# Altium schematic sheet Thermal_Sens.SchDoc
size 259 x 167 mm; SheetNumber: 13; SheetTotal: 15
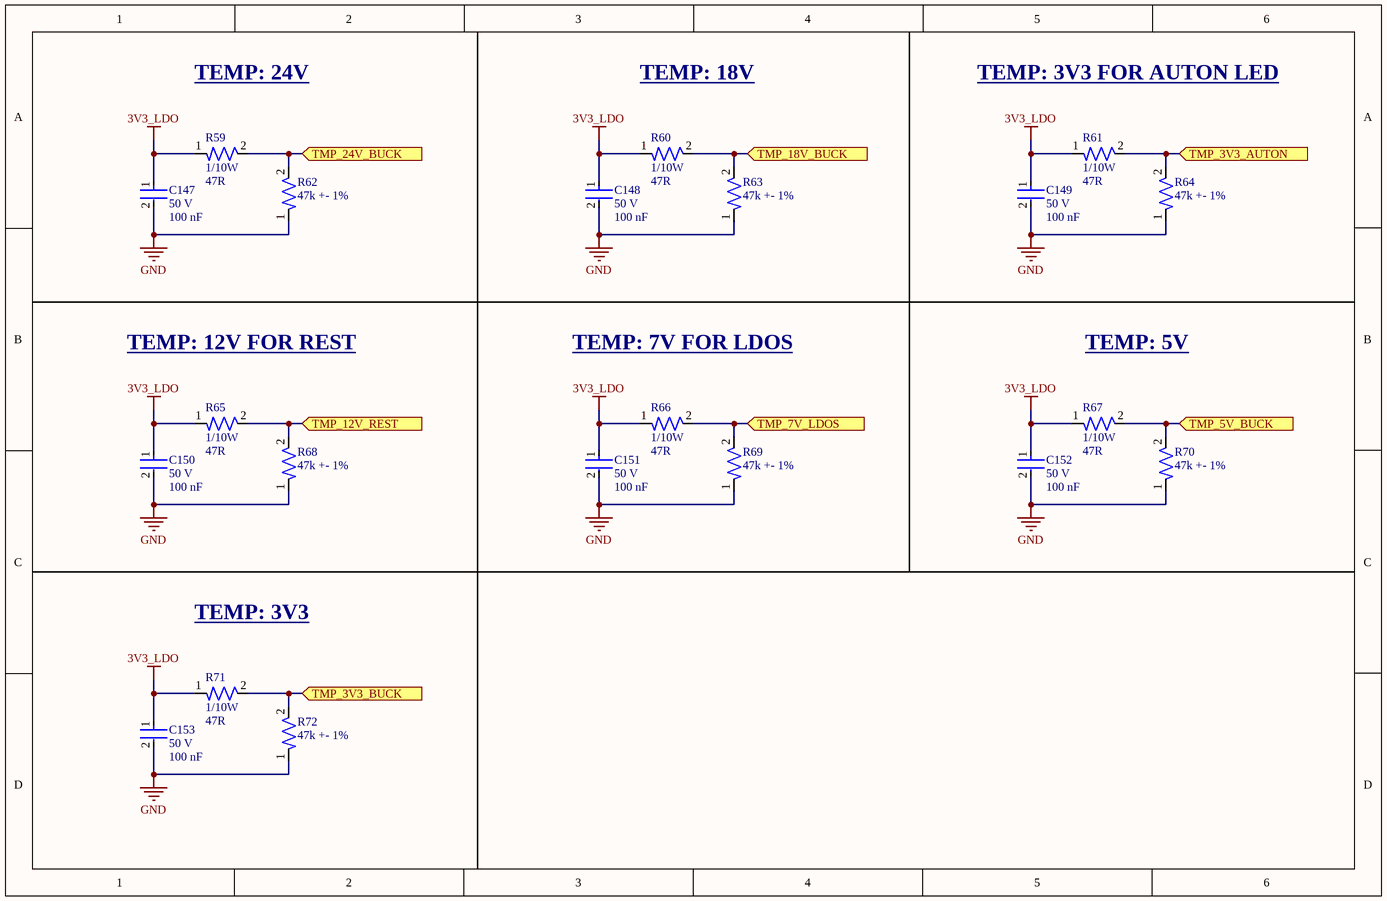
[diagram p0: Thermal_Sens.SchDoc]

## Parts
C147  Voltage Rating: 50 V  Capacitance: 100 nF  [CAP-0805]  (hidden comment: CC0805KRX7R9BB104)
C148  Voltage Rating: 50 V  Capacitance: 100 nF  [CAP-0805]  (hidden comment: CC0805KRX7R9BB104)
C149  Voltage Rating: 50 V  Capacitance: 100 nF  [CAP-0805]  (hidden comment: CC0805KRX7R9BB104)
C150  Voltage Rating: 50 V  Capacitance: 100 nF  [CAP-0805]  (hidden comment: CC0805KRX7R9BB104)
C151  Voltage Rating: 50 V  Capacitance: 100 nF  [CAP-0805]  (hidden comment: CC0805KRX7R9BB104)
C152  Voltage Rating: 50 V  Capacitance: 100 nF  [CAP-0805]  (hidden comment: CC0805KRX7R9BB104)
C153  Voltage Rating: 50 V  Capacitance: 100 nF  [CAP-0805]  (hidden comment: CC0805KRX7R9BB104)
R59  Power: 1/10W  Resistance: 47R  [RES-0603]  (hidden comment: RC0603FR-0747RL)
R60  Power: 1/10W  Resistance: 47R  [RES-0603]  (hidden comment: RC0603FR-0747RL)
R61  Power: 1/10W  Resistance: 47R  [RES-0603]  (hidden comment: RC0603FR-0747RL)
R62  Resistance: 47k +- 1%  [RES-0402]  (hidden comment: TMP6431DECR)
R63  Resistance: 47k +- 1%  [RES-0402]  (hidden comment: TMP6431DECR)
R64  Resistance: 47k +- 1%  [RES-0402]  (hidden comment: TMP6431DECR)
R65  Power: 1/10W  Resistance: 47R  [RES-0603]  (hidden comment: RC0603FR-0747RL)
R66  Power: 1/10W  Resistance: 47R  [RES-0603]  (hidden comment: RC0603FR-0747RL)
R67  Power: 1/10W  Resistance: 47R  [RES-0603]  (hidden comment: RC0603FR-0747RL)
R68  Resistance: 47k +- 1%  [RES-0402]  (hidden comment: TMP6431DECR)
R69  Resistance: 47k +- 1%  [RES-0402]  (hidden comment: TMP6431DECR)
R70  Resistance: 47k +- 1%  [RES-0402]  (hidden comment: TMP6431DECR)
R71  Power: 1/10W  Resistance: 47R  [RES-0603]  (hidden comment: RC0603FR-0747RL)
R72  Resistance: 47k +- 1%  [RES-0402]  (hidden comment: TMP6431DECR)

## Ports
TMP_3V3_AUTON (in), TMP_3V3_BUCK (in), TMP_5V_BUCK (in), TMP_7V_LDOS (in), TMP_12V_REST (in), TMP_18V_BUCK (in), TMP_24V_BUCK (in)

## Nets
3V3_LDO: C147.1 C148.1 C149.1 C150.1 C151.1 C152.1 C153.1 R59.1 R60.1 R61.1 R65.1 R66.1 R67.1 R71.1
GND: C147.2 C148.2 C149.2 C150.2 C151.2 C152.2 C153.2 R62.1 R63.1 R64.1 R68.1 R69.1 R70.1 R72.1
TMP_3V3_AUTON: R61.2 R64.2 ; port TMP_3V3_AUTON
TMP_3V3_BUCK: R71.2 R72.2 ; port TMP_3V3_BUCK
TMP_5V_BUCK: R67.2 R70.2 ; port TMP_5V_BUCK
TMP_7V_LDOS: R66.2 R69.2 ; port TMP_7V_LDOS
TMP_12V_REST: R65.2 R68.2 ; port TMP_12V_REST
TMP_18V_BUCK: R60.2 R63.2 ; port TMP_18V_BUCK
TMP_24V_BUCK: R59.2 R62.2 ; port TMP_24V_BUCK

## Notes on the sheet
- TEMP: 24V
- TEMP: 18V
- TEMP: 3V3 FOR AUTON LED
- TEMP: 12V FOR REST
- TEMP: 7V FOR LDOS
- TEMP: 5V
- TEMP: 3V3

## Library data of the parts
C147-C153 = CAP-0.1U-0002: CAP CER 0.1UF 50V X7R 0805; ComponentLink2Description: Datasheet; ComponentLink2URL: https://www.yageo.com/upload/media/product/productsearch/datasheet/mlcc/UPY-GPHC_X7R_6.3V-to-250V_24.pdf; Device Class: Ceramic; Size: 0805
R59-R61 R65-R67 R71 = RES-47-0001: RES 47 OHM 1% 1/10W 0603; Tolerance: 1%; Size: 0603; ComponentLink1Description: Datasheet; ComponentLink1URL: https://www.yageo.com/upload/media/product/products/datasheet/rchip/PYu-RC_Group_51_RoHS_L_12.pdf
R62-R64 R68-R70 R72 = RES-47k-0001: PTC Thermistor 47 kOhms 0402 (1006 Metric)